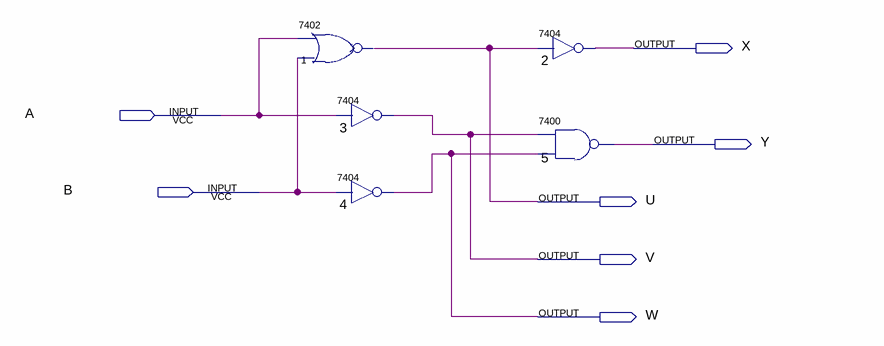
[diagram p0: schematic sheet]
// Quartus schematic Project.bdf as structural Verilog: 5 symbols, 7 pins
module Project (
  input  A,
  input  B,
  output X,
  output Y,
  output U,
  output V,
  output W
);

  \7402  u_1 (.\2 (A), .\3 (B), .\1 (U));
  \7404  u_3 (.\2 (A), .\1 (V));
  \7404  u_4 (.\2 (B), .\1 (W));
  \7404  u_2 (.\2 (U), .\1 (X));
  \7400  u_5 (.\3 (W), .\2 (V), .\1 (Y));
endmodule
